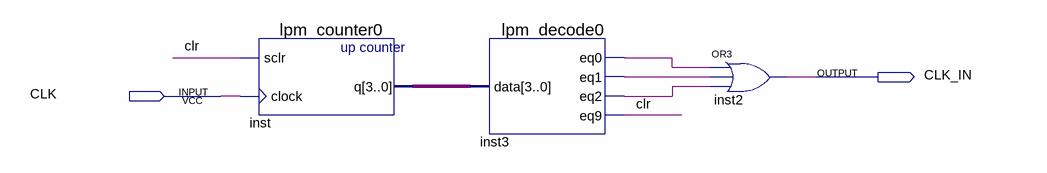
[diagram p0: schematic sheet]
// Quartus schematic Block_1.bdf as structural Verilog: 3 symbols, 2 pins
module Block_1 (
  input  CLK,
  output CLK_IN
);

  wire clr, inst3_eq0, inst3_eq1, inst3_eq2;
  wire [3:0] inst_q;

  lpm_counter0 inst (.sclr(clr), .clock(CLK), .q(inst_q));
  lpm_decode0 inst3 (.data(inst_q), .eq0(inst3_eq0), .eq1(inst3_eq1), .eq2(inst3_eq2), .eq9(clr));
  or inst2 (CLK_IN, inst3_eq0, inst3_eq1, inst3_eq2);
endmodule
